# Altium schematic sheet Microcontroller_rev2.SchDoc
size A4
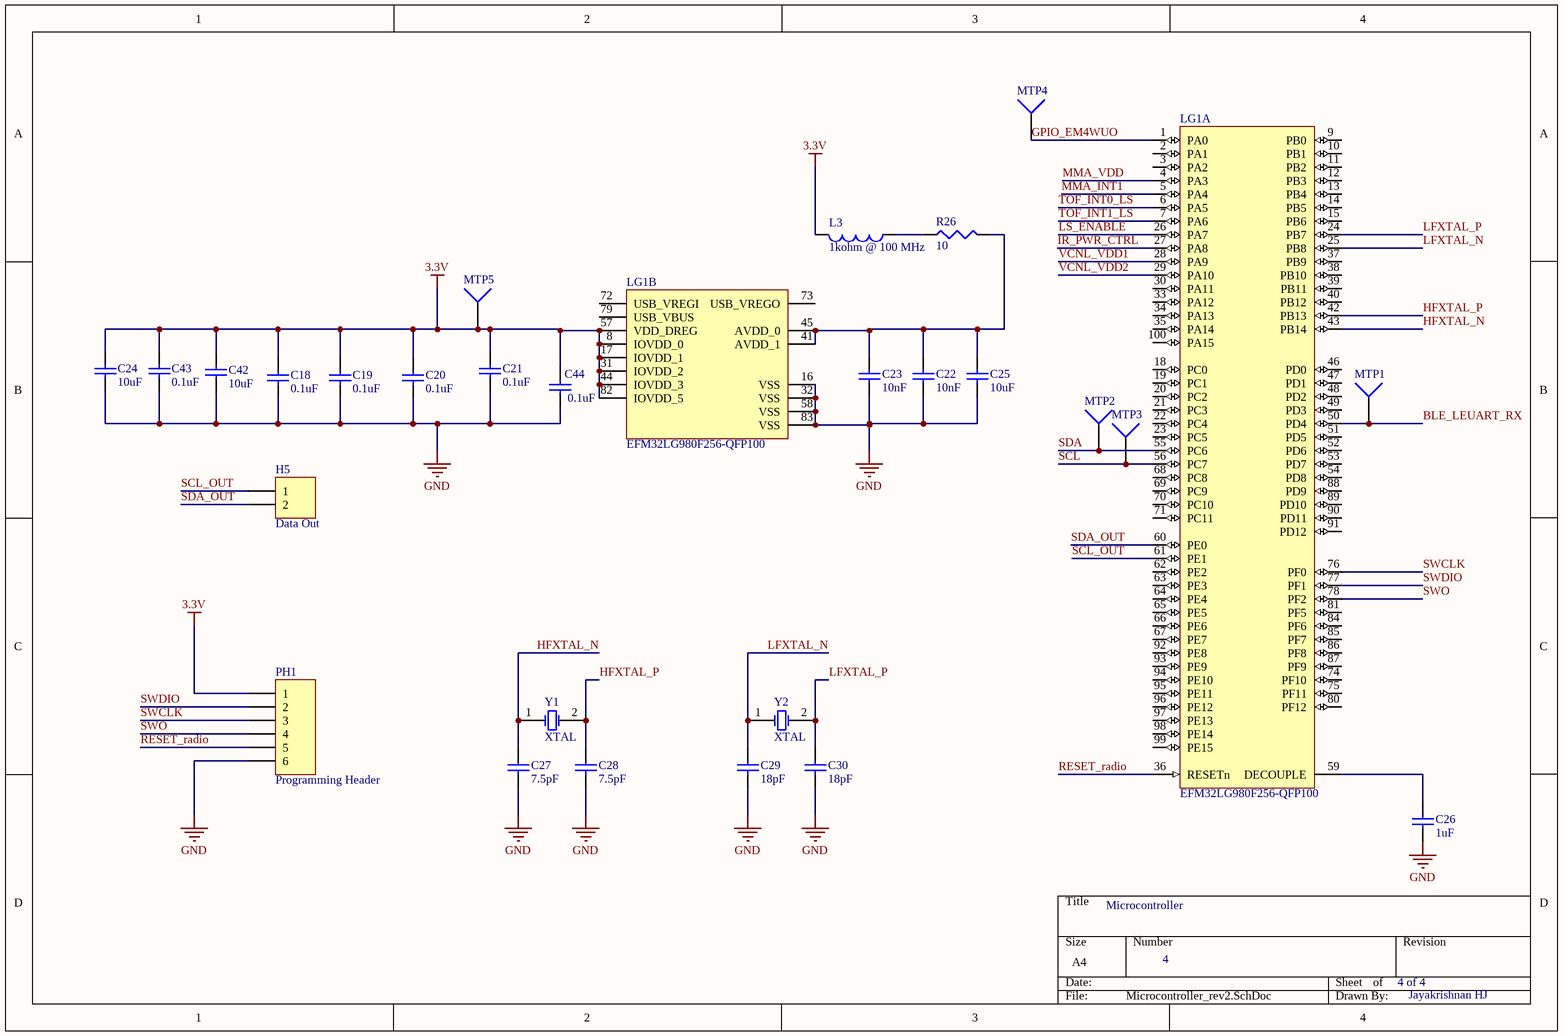
[diagram p0: Microcontroller_rev2.SchDoc]

## Parts
C18  value 0.1uF  [1608[0603]]  (hidden comment: Cap Semi)
C19  value 0.1uF  [1608[0603]]  (hidden comment: Cap Semi)
C20  value 0.1uF  [1608[0603]]  (hidden comment: Cap Semi)
C21  value 0.1uF  [1608[0603]]  (hidden comment: Cap Semi)
C22  value 10nF  [1608[0603]]  (hidden comment: Cap Semi)
C23  value 10nF  [1608[0603]]  (hidden comment: Cap Semi)
C24  value 10uF  [1608[0603]]  (hidden comment: Cap Semi)
C25  value 10uF  [1608[0603]]  (hidden comment: Cap Semi)
C26  value 1uF  [1608[0603]]  (hidden comment: Cap Semi)
C27  value 7.5pF  [1608[0603]]  (hidden comment: Cap Semi)
C28  value 7.5pF  [1608[0603]]  (hidden comment: Cap Semi)
C29  value 18pF  [1608[0603]]  (hidden comment: Cap Semi)
C30  value 18pF  [1608[0603]]  (hidden comment: Cap Semi)
C42  value 10uF  [1608[0603]]  (hidden comment: Cap Semi)
C43  value 0.1uF  [1608[0603]]  (hidden comment: Cap Semi)
C44  value 0.1uF  [1608[0603]]  (hidden comment: Cap Semi)
H5  Data Out  [HDR1X2]
L3  value 1kohm @ 100 MHz  [6-0805_M]  (hidden comment: Inductor)
LG1  EFM32LG980F256-QFP100  [ENMR-LQFP100_M]  (parts A,B of 2)
MTP1  Socket  [PIN1]  (value not drawn)
MTP2  Socket  [PIN1]  (value not drawn)
MTP3  Socket  [PIN1]  (value not drawn)
MTP4  Socket  [PIN1]  (value not drawn)
MTP5  Socket  [PIN1]  (value not drawn)
PH1  Programming Header  [HDR1X6]
R26  value 10  [J1-0603]  (hidden comment: Res3)
Y1  XTAL  [Clock_LFXTAL]
Y2  XTAL  [Clock_LFXTAL]

## Nets
3.3V: C18.2 C19.2 C20.2 C21.2 C24.2 C42.2 C43.2 C44.2 L3.2 LG1.8(IOVDD_0) LG1.17(IOVDD_1) LG1.31(IOVDD_2) LG1.44(IOVDD_3) LG1.57(VDD_DREG) LG1.82(IOVDD_5) MTP5.1 PH1.1
GND: C18.1 C19.1 C20.1 C21.1 C22.1 C23.1 C24.1 C25.1 C26.1 C27.1 C28.1 C29.1 C30.1 C42.1 C43.1 C44.1 LG1.16(VSS) LG1.32(VSS) LG1.58(VSS) LG1.83(VSS) PH1.6
BLE_LEUART_RX: LG1.50(PD4) MTP1.1
GPIO_EM4WUO: LG1.1(PA0) MTP4.1
HFXTAL_N: C27.2 LG1.43(PB14) Y1.1(OSC1)
HFXTAL_P: C28.2 LG1.42(PB13) Y1.2(OSC2)
IR_PWR_CTRL: LG1.27(PA8)
LFXTAL_N: C29.2 LG1.25(PB8) Y2.1(OSC1)
LFXTAL_P: C30.2 LG1.24(PB7) Y2.2(OSC2)
LS_ENABLE: LG1.26(PA7)
MMA_INT1: LG1.5(PA4)
MMA_VDD: LG1.4(PA3)
RESET_radio: LG1.36(RESETn) PH1.5
SCL: LG1.56(PC7) MTP3.1
SCL_OUT: H5.1 LG1.61(PE1)
SDA: LG1.55(PC6) MTP2.1
SDA_OUT: H5.2 LG1.60(PE0)
SWCLK: LG1.76(PF0) PH1.3
SWDIO: LG1.77(PF1) PH1.2
SWO: LG1.78(PF2) PH1.4
TOF_INT0_LS: LG1.6(PA5)
TOF_INT1_LS: LG1.7(PA6)
VCNL_VDD1: LG1.28(PA9)
VCNL_VDD2: LG1.29(PA10)
NetC22_2: C22.2 C23.2 C25.2 LG1.41(AVDD_1) LG1.45(AVDD_0) R26.2
NetC26_2: C26.2 LG1.59(DECOUPLE)
NetL3_1: L3.1 R26.1

Not connected (* = marked no-connect by the designer): LG1 2(PA1) 3(PA2) 9(PB0) 10(PB1) 11(PB2) 12(PB3) 13(PB4) 14(PB5) 15(PB6) 18(PC0) 19(PC1) 20(PC2) 21(PC3) 22(PC4) 23(PC5) 30(PA11) 33(PA12) 34(PA13) 35(PA14) 37(PB9) 38(PB10) 39(PB11) 40(PB12) 46(PD0) 47(PD1) 48(PD2) 49(PD3) 51(PD5) 52(PD6) 53(PD7) 54(PD8) 62(PE2) 63(PE3) 64(PE4) 65(PE5) 66(PE6) 67(PE7) 68(PC8) 69(PC9) 70(PC10) 71(PC11) 72(USB_VREGI) 73(USB_VREGO) 74(PF10) 75(PF11) 79(USB_VBUS) 80(PF12) 81(PF5) 84(PF6) 85(PF7) 86(PF8) 87(PF9) 88(PD9) 89(PD10) 90(PD11) 91(PD12) 92(PE8) 93(PE9) 94(PE10) 95(PE11) 96(PE12) 97(PE13) 98(PE14) 99(PE15) 100(PA15)

## Notes on the sheet
- Microcontroller
- 4
- 4 of 4
- Jayakrishnan HJ

## Library data of the parts
C18-C21 C43 C44 = Cap Semi: CAP CER 0.1UF 10V X7R 0603; Manufacturer: KEMET; Manufacturer Part Number: C0603C104K8RACTU; ComponentLink1Description: Datasheet; ComponentLink1URL: http://www.kemet.com/Lists/ProductCatalog/Attachments/53/KEM_C1002_X7R_SMD.pdf; Digikey Part No: 399-1095-1-ND
C22 C23 = Cap Semi: CAP CER 10000PF 50V X7R 0603; Manufacturer: Yageo; Manufacturer Part Number: CC0603KRX7R9BB103; ComponentLink1Description: Datasheet; ComponentLink1URL: http://www.yageo.com/exep/pages/download/literatures/ProductSelectionGuide%202014_Final_2.pdf; Digikey Part No: 311-1085-1-ND
C24 C25 C42 = Cap Semi: CAP CER 10UF 10V X5R 0603; Manufacturer: Murata Electronics North America; Manufacturer Part Number: GRM188R61A106KE69D; ComponentLink1Description: Datasheet; ComponentLink1URL: http://search.murata.co.jp/Ceramy/image/img/A01X/partnumbering_e_01.pdf; Digikey Part No: 490-10474-1-ND
C26 = Cap Semi: CAP CER 1UF 10V X7R 0603; Manufacturer: Samsung Electro-Mechanics America, Inc.; Manufacturer Part Number: CL10B105KP8NNNC; ComponentLink1Description: Datasheet; ComponentLink1URL: http://www.digikey.com/product-detail/en/samsung-electro-mechanics-america-inc/CL10B105KP8NNNC/1276-1946-1-ND/3890032; Digikey Part No: 1276-1946-1-ND
C27 C28 = Cap Semi: Multilayer Ceramic Capacitors MLCC - SMD/SMT 25V 7.5pF C0G 0201 .1pF Tol; Manufacturer: AVX; Manufacturer Part Number: 02013A7R5BAT2A; ComponentLink1Description: Datasheet; ComponentLink1URL: http://www.mouser.com/ProductDetail/AVX/02013A7R5BAT2A/?qs=sGAEpiMZZMs0AnBnWHyRQB52zW9BgkFE2gr3mrXUPHs%3d; Mouser Part No: 581-02013A7R5BAT2A
C29 C30 = Cap Semi: CAP CER 18PF 250V NP0 0603; Manufacturer: Johanson Technology Inc.; Manufacturer Part Number: 251R14S180GV4T; ComponentLink1Description: Datasheet; ComponentLink1URL: http://www.digikey.com/product-detail/en/johanson-technology-inc/251R14S180GV4T/712-1321-1-ND/1786783; Digikey Part No: 712-1321-1-ND
H5 = Header 2: Header, 2-Pin; LatestRevisionDate: 17-Jul-2002; LatestRevisionNote: Re-released for DXP Platform.; Publisher: Altium Limited
L3 = Inductor: FERRITE BEAD 1 KOHM 0805 1LN; Manufacturer: Murata Electronics North America; Manufacturer Part Number: BLM21BD102SN1D; ComponentLink1Description: Datasheet; ComponentLink1URL: http://www.murata.com/en-global/products/productdata/8796733767710/S0580E.pdf; Digikey Part No: 490-1047-1-ND
LG1 = EFM32LG980F256-QFP100: ARM Microcontrollers - MCU 256k Flash 32k RAM USB 8x34 LCD AES; Manufacturer: Silicon Labs; Manufacturer Part Number: EFM32LG980F256G-E-QFP100; ComponentLink1URL: http://www.mouser.com/ProductDetail/Silicon-Labs/EFM32LG980F256G-E-QFP100/?qs=sGAEpiMZZMuoKKEcg8mMKOIXatb8SC9JzN0ocJGBCFebEz30rQzUmA%3d%3d; Mouser Part No: 634-EFM32LG980F256GE; ComponentLink1Description: link
PH1 = Header 6: Header, 6-Pin; Digikey Part No: *; ComponentLink1Description: *; ComponentLink1URL: *; Manufacturer: *; Manufacturer Part Number: *; Value: *
R26 = Res3: RES SMD 10 OHM 1% 1/10W 0603; Manufacturer: Yageo; Manufacturer Part Number: RC0603FR-0710RL; ComponentLink1URL: http://www.digikey.com/product-detail/en/yageo/RC0603FR-0710RL/311-10.0HRCT-ND/729826; ComponentLink1Description: Datasheet; Digikey Part No: 311-10.0HRCT-ND
Y1 = XTAL: Crystal Oscillator; Published: 8-Jun-2000; LatestRevisionDate: 17-Jul-2002; LatestRevisionNote: Re-released for DXP Platform.; PackageReference: R38; Publisher: Altium Limited; PackageDescription: Crystal, Thru-Hole; 2 Leads; Body 3.1 x 8.2 mm (Dia.xH)
Y2 = XTAL: CRYSTAL 32.7680KHZ 12.5PF SMD; Manufacturer: Abracon LLC; Manufacturer Part Number: AB26TRQ-32.768KHZ-T; Digikey Part No: 535-12051-1-ND; ComponentLink1URL: https://www.digikey.com/products/en/crystals-oscillators-resonators/crystals/171?k=+AB26TRQ&k=&pkeyword=+AB26TRQ&pv7=2&mnonly=0&newproducts=0&ColumnSort=0&page=1&quantity=0&ptm=0&fid=0&pageSize=25; ComponentLink1Description: link
MTP1-MTP5 = Socket: LatestRevisionDate: 17-Jul-2002; LatestRevisionNote: Re-released for DXP Platform.; Publisher: Altium Limited